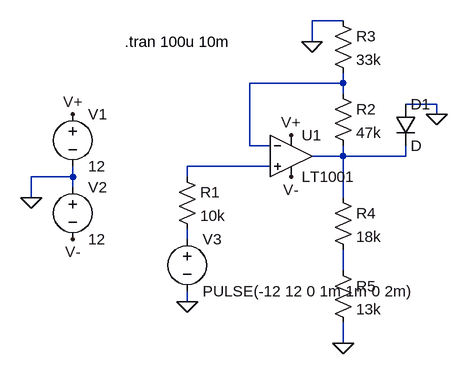
[diagram p0: schematic cv-protection.asc]
cv-protection.asc, the LTspice schematic file:
Version 4
SHEET 1 880 680
WIRE 448 32 400 32
WIRE 400 64 400 32
WIRE 448 128 448 112
WIRE 448 128 304 128
WIRE 448 144 448 128
WIRE 592 160 544 160
WIRE 592 176 592 160
WIRE 304 224 304 128
WIRE 336 224 304 224
WIRE 448 240 448 224
WIRE 448 240 400 240
WIRE 544 240 544 224
WIRE 544 240 448 240
WIRE 336 256 208 256
WIRE 32 272 32 256
WIRE 32 272 -32 272
WIRE 208 272 208 256
WIRE 32 288 32 272
WIRE -32 304 -32 272
WIRE 448 304 448 240
WIRE 208 368 208 352
WIRE 448 416 448 384
WIRE 208 464 208 448
WIRE 448 528 448 496
FLAG 448 528 0
FLAG 400 64 0
FLAG 208 464 0
FLAG -32 304 0
FLAG 32 176 V+
FLAG 368 208 V+
FLAG 32 368 V-
FLAG 368 272 V-
FLAG 592 176 0
SYMBOL OpAmps/LT1001 368 176 R0
SYMATTR InstName U1
SYMBOL voltage 32 160 R0
SYMATTR InstName V1
SYMATTR Value 12
SYMBOL voltage 32 272 R0
SYMATTR InstName V2
SYMATTR Value 12
SYMBOL voltage 208 352 R0
SYMATTR InstName V3
SYMATTR Value PULSE(-12 12 0 1m 1m 0 2m)
SYMBOL res 192 256 R0
SYMATTR InstName R1
SYMATTR Value 10k
SYMBOL res 432 128 R0
SYMATTR InstName R2
SYMATTR Value 47k
SYMBOL res 432 16 R0
SYMATTR InstName R3
SYMATTR Value 33k
SYMBOL res 432 288 R0
SYMATTR InstName R4
SYMATTR Value 18k
SYMBOL res 432 400 R0
SYMATTR InstName R5
SYMATTR Value 13k
SYMBOL diode 528 160 R0
SYMATTR InstName D1
TEXT 112 64 Left 2 !.tran 100u 10m

The netlist it stands for:
* cv-protection.asc
XU1 N003 N001 V+ V- N002 LT1001  ; pins In+ In- V+ V- OUT
V1 V+ 0 12
V2 0 V- 12
V3 N004 0 PULSE(-12 12 0 1m 1m 0 2m)
R1 N003 N004 10k
R2 N001 N002 47k
R3 0 N001 33k
R4 N002 N005 18k
R5 N005 0 13k
D1 0 N002 D
.model D D
.lib standard.dio
.tran 100u 10m
.lib LTC.lib
.backanno
.end